# EAGLE design Power Board (EAGLE 6.1)
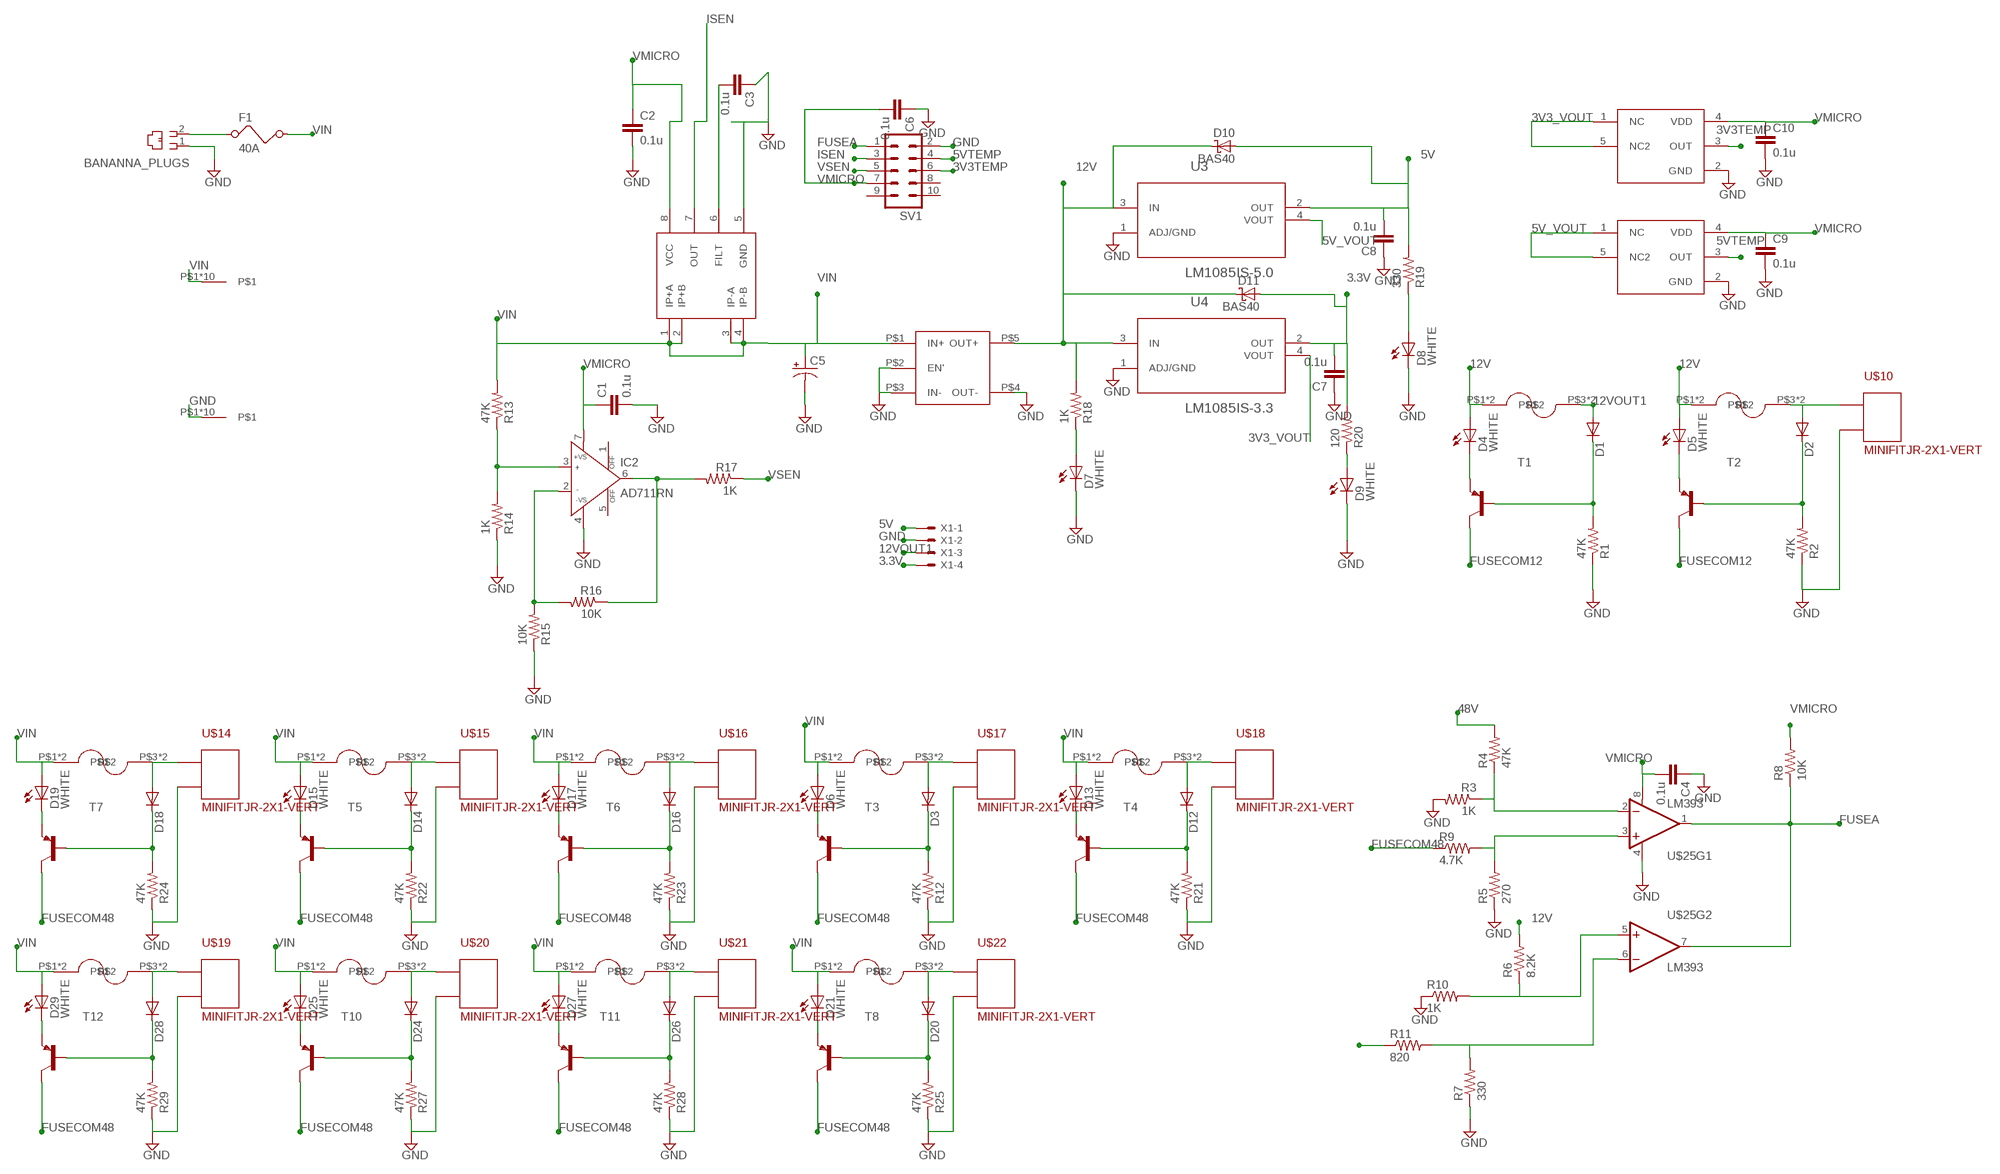
[diagram p0: schematic, sheet 1]

## Parts
BANANNA_PLUGS  520470-4  [520470-4]
C1  0.1u  CAP0805  [0805]
C2  0.1u  CAP0805  [0805]
C3  0.1u  CAP0805  [0805]
C4  0.1u  CAP0805  [0805]
C5  CPOL-USE10-30  [EB30D]
C6  0.1u  CAP0805  [0805]
C7  0.1u  CAP0805  [0805]
C8  0.1u  CAP0805  [0805]
C9  0.1u  CAP0805  [0805]
C10  0.1u  CAP0805  [0805]
D1  DIODEHV  [DIODE-HV]
D2  DIODEHV  [DIODE-HV]
D3  DIODEHV  [DIODE-HV]
D4  WHITE  LED-WHITE  [LED-1206]
D5  WHITE  LED-WHITE  [LED-1206]
D6  WHITE  LED-WHITE  [LED-1206]
D7  WHITE  LED-WHITE  [LED-1206]
D8  WHITE  LED-WHITE  [LED-1206]
D9  WHITE  LED-WHITE  [LED-1206]
D10  BAS40  [SOT23]
D11  BAS40  [SOT23]
D12  DIODEHV  [DIODE-HV]
D13  WHITE  LED-WHITE  [LED-1206]
D14  DIODEHV  [DIODE-HV]
D15  WHITE  LED-WHITE  [LED-1206]
D16  DIODEHV  [DIODE-HV]
D17  WHITE  LED-WHITE  [LED-1206]
D18  DIODEHV  [DIODE-HV]
D19  WHITE  LED-WHITE  [LED-1206]
D20  DIODEHV  [DIODE-HV]
D21  WHITE  LED-WHITE  [LED-1206]
D24  DIODEHV  [DIODE-HV]
D25  WHITE  LED-WHITE  [LED-1206]
D26  DIODEHV  [DIODE-HV]
D27  WHITE  LED-WHITE  [LED-1206]
D28  DIODEHV  [DIODE-HV]
D29  WHITE  LED-WHITE  [LED-1206]
F1  40A  FUSE  [FUSE]
IC2  AD711RN  [SO8]
R1  47K  RESISTOR0805-RES  [0805]
R2  47K  RESISTOR0805-RES  [0805]
R3  1K  RESISTOR0805-RES  [0805]
R4  47K  RESISTOR0805-RES  [0805]
R5  270  RESISTOR0805-RES  [0805]
R6  8.2K  RESISTOR0805-RES  [0805]
R7  330  RESISTOR0805-RES  [0805]
R8  10K  RESISTOR0805-RES  [0805]
R9  4.7K  RESISTOR0805-RES  [0805]
R10  1K  RESISTOR0805-RES  [0805]
R11  820  RESISTOR0805-RES  [0805]
R12  47K  RESISTOR0805-RES  [0805]
R13  47K  RESISTOR0805-RES  [0805]
R14  1K  RESISTOR0805-RES  [0805]
R15  10K  RESISTOR0805-RES  [0805]
R16  10K  RESISTOR0805-RES  [0805]
R17  1K  RESISTOR0805-RES  [0805]
R18  1K  RESISTOR0805-RES  [0805]
R19  330  RESISTOR0805-RES  [0805]
R20  120  RESISTOR0805-RES  [0805]
R21  47K  RESISTOR0805-RES  [0805]
R22  47K  RESISTOR0805-RES  [0805]
R23  47K  RESISTOR0805-RES  [0805]
R24  47K  RESISTOR0805-RES  [0805]
R25  47K  RESISTOR0805-RES  [0805]
R27  47K  RESISTOR0805-RES  [0805]
R28  47K  RESISTOR0805-RES  [0805]
R29  47K  RESISTOR0805-RES  [0805]
SV1  MA05-2  [MA05-2]
T1  BC856BLT1-PNP-SOT23-BEC  [SOT23-BEC]
T2  BC856BLT1-PNP-SOT23-BEC  [SOT23-BEC]
T3  BC856BLT1-PNP-SOT23-BEC  [SOT23-BEC]
T4  BC856BLT1-PNP-SOT23-BEC  [SOT23-BEC]
T5  BC856BLT1-PNP-SOT23-BEC  [SOT23-BEC]
T6  BC856BLT1-PNP-SOT23-BEC  [SOT23-BEC]
T7  BC856BLT1-PNP-SOT23-BEC  [SOT23-BEC]
T8  BC856BLT1-PNP-SOT23-BEC  [SOT23-BEC]
T10  BC856BLT1-PNP-SOT23-BEC  [SOT23-BEC]
T11  BC856BLT1-PNP-SOT23-BEC  [SOT23-BEC]
T12  BC856BLT1-PNP-SOT23-BEC  [SOT23-BEC]
U3  LM1085IS-5.0  [TO254P1435X457-3N]
U4  LM1085IS-3.3  [TO254P1435X457-3N]
U$1  SQE48T20120  [BRICK]
U$2  FUSEHOLDER3557-2  [FUSEHOLDER3557-2]
U$3  FUSEHOLDER3557-2  [FUSEHOLDER3557-2]
U$4  FUSEHOLDER3557-2  [FUSEHOLDER3557-2]
U$5  FUSEHOLDER3557-2  [FUSEHOLDER3557-2]
U$6  FUSEHOLDER3557-2  [FUSEHOLDER3557-2]
U$7  FUSEHOLDER3557-2  [FUSEHOLDER3557-2]
U$8  FUSEHOLDER3557-2  [FUSEHOLDER3557-2]
U$9  FUSEHOLDER3557-2  [FUSEHOLDER3557-2]
U$10  MINIFITJR-2X1-VERT  [5566-02B]
U$11  FUSEHOLDER3557-2  [FUSEHOLDER3557-2]
U$12  FUSEHOLDER3557-2  [FUSEHOLDER3557-2]
U$13  FUSEHOLDER3557-2  [FUSEHOLDER3557-2]
U$14  MINIFITJR-2X1-VERT  [5566-02B]
U$15  MINIFITJR-2X1-VERT  [5566-02B]
U$16  MINIFITJR-2X1-VERT  [5566-02B]
U$17  MINIFITJR-2X1-VERT  [5566-02B]
U$18  MINIFITJR-2X1-VERT  [5566-02B]
U$19  MINIFITJR-2X1-VERT  [5566-02B]
U$20  MINIFITJR-2X1-VERT  [5566-02B]
U$21  MINIFITJR-2X1-VERT  [5566-02B]
U$22  MINIFITJR-2X1-VERT  [5566-02B]
U$25  LM393  [SO08]
U$26  MCP9700T  [SOT353]
U$27  MCP9700T  [SOT353]
U$30  SCREW_TERM  [TERMINAL]
U$31  SCREW_TERM  [TERMINAL]
U$32  ACS713  [SOP08]
X1  KK-156-4  [KK-156-4]

## Nets
3.3V: C7.2 D11.1(A) R20.2 U4.2(OUT) X1.4
3V3_VOUT: U4.4(VOUT) U$27.1(NC) U$27.5(NC2)
3V3TEMP: SV1.6 U$27.3(OUT)
5V: C8.2 D10.1(A) R19.2 U3.2(OUT) X1.1
5V_VOUT: U3.4(VOUT) U$26.1(NC) U$26.5(NC2)
5VTEMP: SV1.4 U$26.3(OUT)
12V: D4.A D5.A D10.3(C) D11.3(C) R6.2 R18.2 U3.3(IN) U4.3(IN) U$1.P$5(OUT+) U$3.P$1 U$3.P$2 U$4.P$1 U$4.P$2
12VOUT1: D1.A U$4.P$3 U$4.P$4 X1.3
48V: R4.2
FUSEA: R8.1 SV1.1 U$25.1(OUT) U$25.7(OUT)
FUSECOM12: R11.1 T1.C T2.C
FUSECOM48: R9.1 T3.C T4.C T5.C T6.C T7.C T8.C T10.C T11.C T12.C
GND: BANANNA_PLUGS.1 C1.2 C2.2 C3.1 C4.1 C5.- C6.1 C7.1 C8.1 C9.2 C10.2 D7.C D8.C D9.C IC2.4(-VS) R1.1 R2.1 R3.2 R5.1 R7.1 R10.1 R12.1 R14.1 R15.1 R21.1 R22.1 R23.1 R24.1 R25.1 R27.1 R28.1 R29.1 SV1.2 U3.1(ADJ/GND) U4.1(ADJ/GND) U$1.P$2(EN') U$1.P$3(IN-) U$1.P$4(OUT-) U$10.P$2 U$14.P$2 U$15.P$2 U$16.P$2 U$17.P$2 U$18.P$2 U$19.P$2 U$20.P$2 U$21.P$2 U$22.P$2 U$25.4(V-) U$26.2(GND) U$27.2(GND) U$31.P$1 U$31.P$2 U$31.P$3 U$31.P$4 U$31.P$5 U$31.P$6 U$31.P$7 U$31.P$8 U$31.P$9 U$31.P$10 U$32.5(GND) X1.2
ISEN: SV1.3 U$32.7(OUT)
N$2: R3.1 R4.1 U$25.2(-IN)
N$3: D2.A U$3.P$3 U$3.P$4 U$10.P$1
N$4: R5.2 R9.2 U$25.3(+IN)
N$5: R6.1 R10.2 U$25.5(+IN)
N$6: R7.2 R11.2 U$25.6(-IN)
N$7: D2.C R2.2 T2.B
N$8: D5.C T2.E
N$9: D3.A U$2.P$3 U$2.P$4 U$17.P$1
N$10: D3.C R12.2 T3.B
N$11: D6.C T3.E
N$12: D1.C R1.2 T1.B
N$13: D4.C T1.E
N$15: C3.2 U$32.6(FILT)
N$16: IC2.3(IN+) R13.1 R14.2
N$17: IC2.2(IN-) R15.2 R16.2
N$18: IC2.6(OUT) R16.1 R17.2
N$21: D7.A R18.1
N$22: D8.A R19.1
N$23: D9.A R20.1
N$25: D12.C R21.2 T4.B
N$26: D13.C T4.E
N$27: BANANNA_PLUGS.2 F1.1
N$28: D12.A U$5.P$3 U$5.P$4 U$18.P$1
N$29: D14.C R22.2 T5.B
N$30: D15.C T5.E
N$32: D14.A U$6.P$3 U$6.P$4 U$15.P$1
N$33: D16.C R23.2 T6.B
N$34: D17.C T6.E
N$36: D16.A U$7.P$3 U$7.P$4 U$16.P$1
N$37: D18.C R24.2 T7.B
N$38: D19.C T7.E
N$40: D18.A U$8.P$3 U$8.P$4 U$14.P$1
N$41: D20.C R25.2 T8.B
N$42: D21.C T8.E
N$44: D20.A U$9.P$3 U$9.P$4 U$22.P$1
N$49: D24.C R27.2 T10.B
N$50: D25.C T10.E
N$52: D24.A U$11.P$3 U$11.P$4 U$20.P$1
N$53: D26.C R28.2 T11.B
N$54: D27.C T11.E
N$56: D26.A U$12.P$3 U$12.P$4 U$21.P$1
N$57: D28.C R29.2 T12.B
N$58: D29.C T12.E
N$60: D28.A U$13.P$3 U$13.P$4 U$19.P$1
VIN: C5.+ D6.A D13.A D15.A D17.A D19.A D21.A D25.A D27.A D29.A F1.2 R13.2 U$1.P$1(IN+) U$2.P$1 U$2.P$2 U$5.P$1 U$5.P$2 U$6.P$1 U$6.P$2 U$7.P$1 U$7.P$2 U$8.P$1 U$8.P$2 U$9.P$1 U$9.P$2 U$11.P$1 U$11.P$2 U$12.P$1 U$12.P$2 U$13.P$1 U$13.P$2 U$30.P$1 U$30.P$2 U$30.P$3 U$30.P$4 U$30.P$5 U$30.P$6 U$30.P$7 U$30.P$8 U$30.P$9 U$30.P$10 U$32.1(IP+A) U$32.2(IP+B) U$32.3(IP-A) U$32.4(IP-B)
VMICRO: C1.1 C2.1 C4.2 C6.2 C9.1 C10.1 IC2.7(+VS) R8.2 SV1.7 U$25.8(V+) U$26.4(VDD) U$27.4(VDD) U$32.8(VCC)
VSEN: R17.1 SV1.5
Unconnected: IC2.1(OFF) IC2.5(OFF) SV1.8 SV1.9 SV1.10

## Library data of the parts
BANANNA_PLUGS = con-amp:520470-4: AMP connector
C1-C4 C6-C10 = SparkFun-Capacitors:CAP: Capacitor Standard 0603 ceramic capacitor, and 0.1" leaded capacitor.
C5 = rcl:CPOL-US: POLARIZED CAPACITOR, American symbol
D1-D3 D12 D14 D16 D18 D20 D24 D26 D28 = SparkFun-DiscreteSemi:DIODE: Diode These are standard reverse protection diodes and small signal diodes. SMA package can handle up to about 1A. SOD-323 can handle about 200mA. What the SOD-323 package when ordering, there are some mfgs out there that are 5-pin packages.
D4-D9 D13 D15 D17 D19 D21 D25 D27 D29 = SparkFun-LED:LED-WHITE: White SMD LEDs LilyPad 1206- DIO-09955; PROD_ID: DIO-09955
D10 D11 = diode:BAS40: Silicon Schottky Diodes General-purpose diode for high-speed switching
F1 = special:FUSE: FUSE 5 x 20 mm
IC2 = analog-devices:AD711: Precision, Low Cost, High Speed, BiFET Op Amp Source: http://www.analog.com/static/imported-files/data_sheets/AD711.pdf; MF: ALTERA CORPORATION; MPN: AD711KRZ; OC_FARNELL: 9426396; OC_NEWARK: 59K4541
R1-R25 R27-R29 = SparkFun-Resistors:RESISTOR: Resistor Basic schematic elements and footprints for 0603, 1206, and PTH resistors.
SV1 = con-lstb:MA05-2: PIN HEADER; OC_FARNELL: unknown; OC_NEWARK: unknown
T1-T8 T10-T12 = transistor:*-PNP-: PNP Transistror
U3 = NSC_By_element14_Batch_1:LM1085IS-5.0: Low Dropout Positive Regulators; MPN: LM1085IS-5.0; OC_FARNELL: 1469040; OC_NEWARK: 41K3374; PACKAGE: TO-263-3; SUPPLIER: National Semiconductor
U4 = NSC_By_element14_Batch_1:LM1085IS-3.3: Low Dropout Positive Regulators; MPN: LM1085IS-3.3; OC_FARNELL: 1469039; OC_NEWARK: 41K3373; PACKAGE: TO-263-3; SUPPLIER: National Semiconductor
U$1 = Power Board Library:SQE48T20120
U$2-U$9 U$11-U$13 = Power Board Library:FUSEHOLDER3557-2
U$10 U$14-U$22 = Personal:MINIFITJR-2X1-VERT
U$25 = SparkFun:LM393
U$26 U$27 = Power Board Library:MCP9700T
U$30 U$31 = Power Board Library:SCREW_TERM
U$32 = main:ACS713
X1 = con-molex:KK-156-4: KK 156 HEADER Source: http://www.molex.com/pdm_docs/sd/026604100_sd.pdf; OC_FARNELL: unknown; OC_NEWARK: unknown

## Board
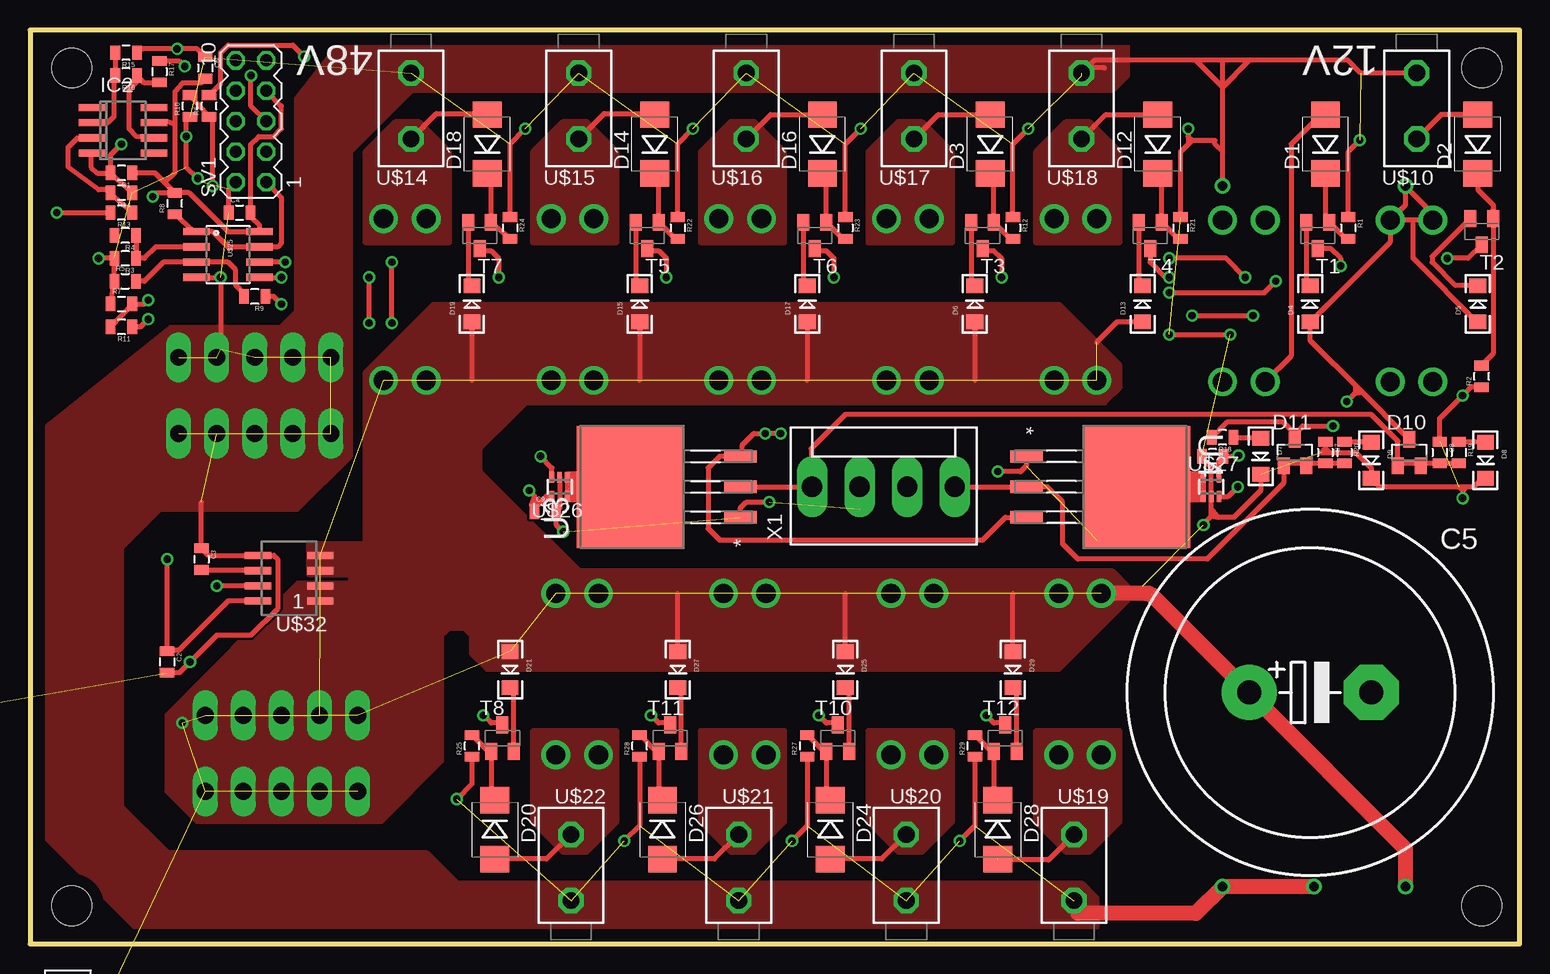
[diagram p1: board, top side]
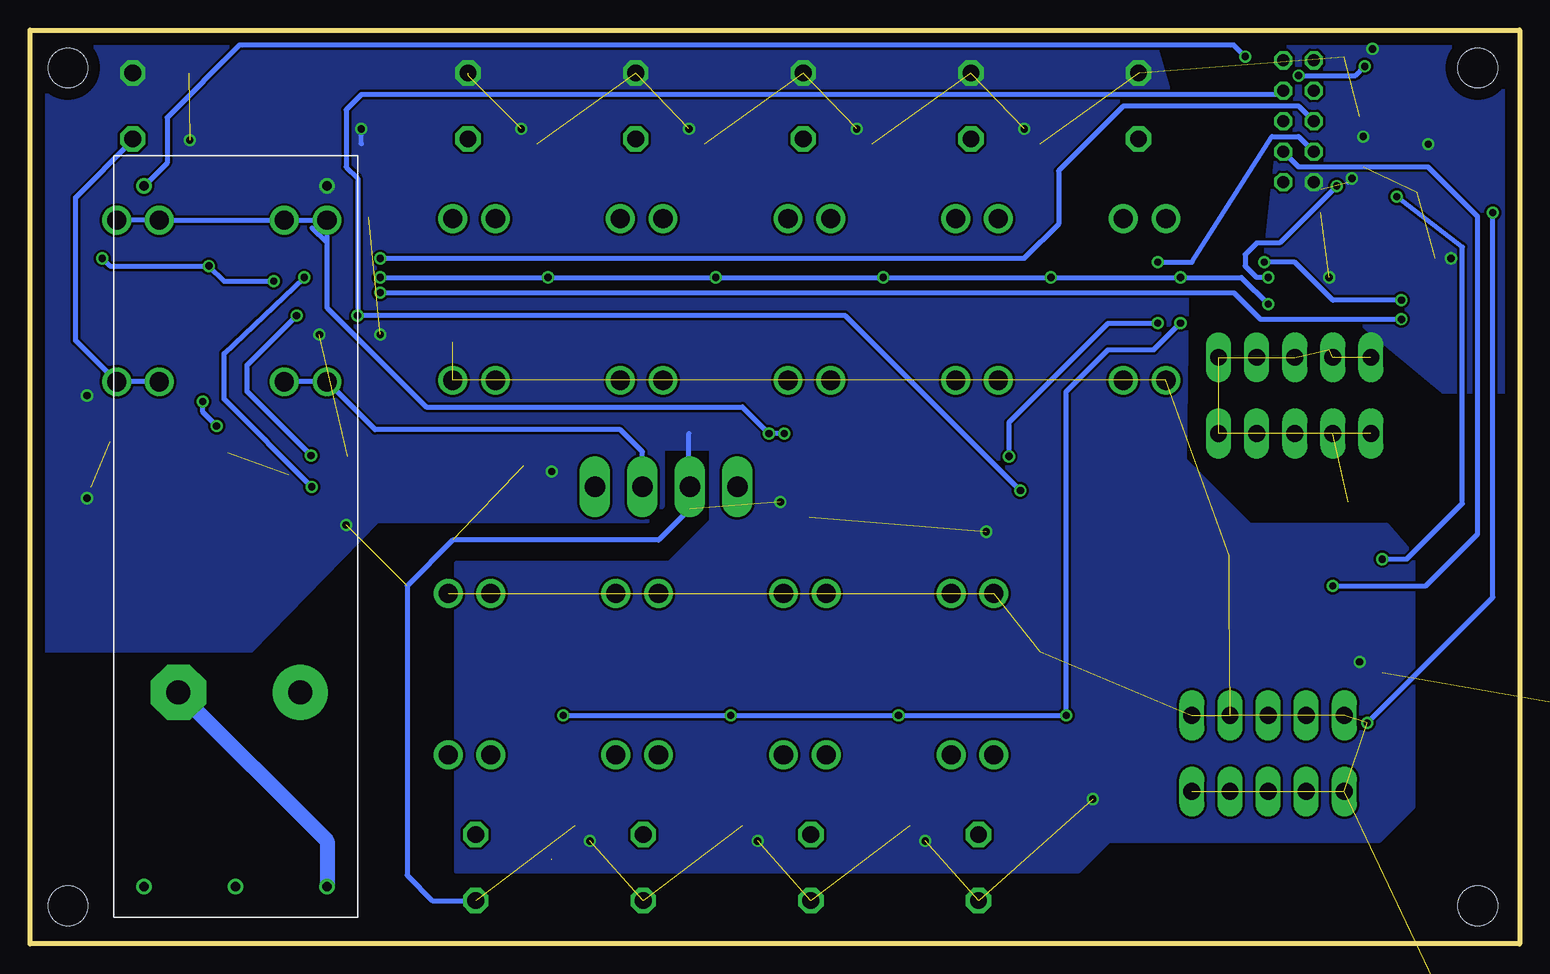
[diagram p2: board, bottom side, seen from below]

Size 124.13 x 76.19 mm. Coordinates in mm from the lower left corner, seen from the top.
Outline: 0,0 124.13,0 124.13,76.19 0,76.19 0,0
Copper layers (1*16): Top 0.035mm / dielectric 1.5mm / Bottom 0.035mm
Design rules: minimum track width 10mil, minimum drill 15mil, track to track 8mil, track to pad 8mil, pad to pad 8mil, via to via 8mil, smd to smd 8mil, copper to edge 40mil, drill to drill 8mil, minimum pad ring 10mil, minimum via ring 8mil, stop-mask expansion 4mil, vias tented up to drill 0mil, thermal gap 10mil

### Footprints (pad centres in the part's own frame; a part is rotated, then mirrored left to right if it is on the bottom)
520470-4 = drill 0.889: 1 -0.635,8.89; 2 0.635,6.35 | hole 3.251: -5.08,0; 5.08,0
0805 = smd 0.8 x 1.2: 1 -0.9,0; 2 0.9,0
EB30D = drill 2.007 pad 4.597: + -5.08,0 | drill 2.007 pad 4.597 octagon: - 5.08,0
DIODE-HV = smd 2.2 x 2.4: A 2.454,0; C -2.454,0
LED-1206 = smd 1.2 x 1.4: A -1.5,0; C 1.5,0
SOT23 = smd 1 x 1.4: 1 -0.95,-1.1; 2 0.95,-1.1; 3 0,1.1
FUSE = drill 1.321 long: 1 -11.43,0; 2 11.43,0
SO8 = smd 0.6 x 2.2: 1 -1.905,-2.6; 2 -0.635,-2.6; 3 0.635,-2.6; 4 1.905,-2.6; 5 1.905,2.6; 6 0.635,2.6; 7 -0.635,2.6; 8 -1.905,2.6
MA05-2 = drill 1.016 octagon: 1 -5.08,-1.27; 2 -5.08,1.27; 3 -2.54,-1.27; 4 -2.54,1.27; 5 0,-1.27; 6 0,1.27; 7 2.54,-1.27; 8 2.54,1.27; 9 5.08,-1.27; 10 5.08,1.27
SOT23-BEC = smd 1 x 1.4: B -0.95,-1.1; C 0,1.1; E 0.95,-1.1
TO254P1435X457-3N = smd 1.016 x 2.692: 1 -2.54,-9.042; 2 0,-9.042; 3 2.54,-9.042 | smd 10.16 x 8.941: 4 0,0.152
BRICK = drill 0.8: P$1 0,7.62; P$2 0,0; P$3 0,-7.62; P$4 58.42,-7.62; P$5 58.42,7.62
FUSEHOLDER3557-2 = drill 1.6: P$1 0,0; P$2 0,3.556; P$3 13.462,0; P$4 13.462,3.556
5566-02B = drill 1.4 octagon: P$1 0,-2.75; P$2 0,2.75
STAND-OFF = hole 3.302: 0,0
SO08 = smd 0.61 x 2.21: 1 -1.905,-2.616; 2 -0.635,-2.616; 3 0.635,-2.616; 4 1.905,-2.616; 5 1.905,2.616; 6 0.635,2.616; 7 -0.635,2.616; 8 -1.905,2.616
SOT353 = smd 0.4 x 0.9: 1 -0.65,-0.8; 2 0,-0.8; 3 0.65,-0.8; 4 0.65,0.8; 5 -0.65,0.8
TERMINAL = drill 1.4 long: P$1 -3.175,0; P$2 3.175,0; P$3 3.175,3.175; P$4 -3.175,3.175; P$5 -3.175,6.35; P$6 3.175,6.35; P$7 3.175,-3.175; P$8 3.175,-6.35; P$9 -3.175,-6.35; P$10 -3.175,-3.175
SOP08 = smd 0.6 x 2.2: 1 -1.905,-2.6; 2 -0.635,-2.6; 3 0.635,-2.6; 4 1.905,-2.6; 5 1.905,2.6; 6 0.635,2.6; 7 -0.635,2.6; 8 -1.905,2.6
KK-156-4 = drill 1.7 pad 2.184 long: 1 -5.94,0; 2 -1.98,0; 3 1.98,0; 4 5.94,0

### Placement (x,y rotation side)
BANANNA_PLUGS  -9.84,9.84 0 top  (outside the outline)
C1  7.62,64.26 180 top
C2  11.43,23.5 270 top
C3  14.29,32.07 270 top
C4  17.46,60.96 0 top
C5  106.68,20.95 0 top
C6  14.61,73.03 270 top
C7  107.95,40.96 270 top
C8  117.47,40.96 270 top
C9  42.93,36 0 top
C10  98.55,40.64 180 top
D1  107.95,66.67 90 top
D2  120.65,66.67 90 top
D3  80.01,66.67 90 top
D4  106.68,53.34 90 top
D5  120.65,53.34 90 top
D6  78.74,53.34 90 top
D7  102.55,40.64 270 top
D8  121.28,40.32 270 top
D9  111.76,40.32 270 top
D10  114.94,40.96 0 top
D11  105.41,40.96 0 top
D12  93.98,66.67 90 top
D13  92.71,53.34 90 top
D14  52.07,66.67 90 top
D15  50.8,53.34 90 top
D16  66.04,66.67 90 top
D17  64.77,53.34 90 top
D18  38.1,66.67 90 top
D19  36.83,53.34 90 top
D20  38.73,9.53 270 top
D21  40.01,22.86 270 top
D24  66.67,9.53 270 top
D25  67.94,22.86 270 top
D26  52.7,9.53 270 top
D27  53.98,22.86 270 top
D28  80.64,9.53 270 top
D29  81.92,22.86 270 top
F1  -5.71,-6.03 0 top  (outside the outline)
IC2  7.75,67.82 270 top
R1  109.86,59.69 270 top
R2  120.97,47.31 90 top
R3  7.94,57.15 180 top
R4  7.94,59.05 180 top
R5  7.94,55.24 0 top
R6  14.92,69.85 90 top
R7  7.62,53.34 0 top
R8  12.06,61.72 90 top
R9  18.73,53.98 180 top
R10  13.34,69.85 90 top
R11  7.62,51.44 180 top
R12  81.92,59.69 270 top
R13  7.62,60.96 180 top
R14  7.62,62.61 180 top
R15  8,74.3 180 top
R16  8,72.39 180 top
R17  10.79,72.71 270 top
R18  99.38,42.23 180 top
R19  119.06,40.96 270 top
R20  109.54,40.96 270 top
R21  95.89,59.69 270 top
R22  53.98,59.69 270 top
R23  67.94,59.69 270 top
R24  40.01,59.69 270 top
R25  36.83,16.51 90 top
R27  64.77,16.51 90 top
R28  50.8,16.51 90 top
R29  78.74,16.51 90 top
SV1  18.41,68.58 90 top
T1  107.31,59.05 180 top
T2  120.97,59.37 180 top
T3  79.38,59.05 180 top
T4  93.34,59.05 180 top
T5  51.44,59.05 180 top
T6  65.41,59.05 180 top
T7  37.47,59.05 180 top
T8  39.37,17.14 0 top
T10  67.31,17.14 0 top
T11  53.34,17.14 0 top
T12  81.28,17.14 0 top
U3  50.16,38.1 90 top
U4  92.08,38.1 270 top
U$1  107,4.76 90 bottom
U$2  74.93,46.99 90 top
U$3  113.35,60.33 270 top
U$4  99.38,60.33 270 top
U$5  88.9,46.99 90 top
U$6  46.99,46.99 90 top
U$7  60.96,46.99 90 top
U$8  33.02,46.99 90 top
U$9  43.81,29.21 270 top
U$10  115.57,69.85 0 top
U$11  71.75,29.21 270 top
U$12  57.78,29.21 270 top
U$13  85.72,29.21 270 top
U$14  31.75,69.85 0 top
U$15  45.72,69.85 0 top
U$16  59.69,69.85 0 top
U$17  73.66,69.85 0 top
U$18  87.63,69.85 0 top
U$19  87,6.35 180 top
U$20  73.03,6.35 180 top
U$21  59.05,6.35 180 top
U$22  45.09,6.35 180 top
U$23  [STAND-OFF]  3.49,3.17 0 top
U$24  [STAND-OFF]  120.97,3.17 0 top
U$25  16.51,57.47 270 top
U$26  44.13,38.1 180 top
U$27  98.42,38.1 0 top
U$28  [STAND-OFF]  120.97,73.03 0 top
U$29  [STAND-OFF]  3.49,73.03 0 top
U$30  20.95,15.88 90 top
U$31  18.73,45.72 90 top
U$32  21.59,30.48 90 top
X1  71.12,38.1 0 top

### Tracks (layer width: path | path; a pad name or v marks a point on that pad's centre or on a via)
3.3V
  Top 0.406: X1.4 U4.2 84.77,38.1 86.04,36.83 86.04,33.34 87.31,32.07 98.11,32.07 104.46,38.42 D11.1 104.66,40.06 C7.2 R20.2
3V3_VOUT
  Top 0.406: U4.4 92.23,38.9 U$27.5 U$27.1
3V3TEMP  (via drill 0.6)
  Top 0.406: v101.28,55.56 99.69,57.15 v94.93,57.15 | U$27.3 99.85,37.3 v100.65,38.1
  Bottom 0.406: v101.28,55.56 107.95,49.21 107.95,45.4 v100.65,38.1 | v94.93,57.15 41.27,57.15 38.42,60.01 38.42,64.45 33.02,69.85 18.41,69.85 SV1.6
5V
  Top 0.406: U3.2 X1.1 65.09,38.19 65.09,41.27 67.94,44.13 111.76,44.13 113.98,41.91 D10.1 114.19,40.06 C8.2 R19.2
5V_VOUT
  Top 0.406: U3.4 50.01,38.9 U$26.1 U$26.5
5VTEMP  (via drill 0.6)
  Top 0.406: v42.55,40.64 43.5,39.69 43.5,38.91 U$26.3 | v30.16,51.75 v30.16,56.83
  Bottom 0.406: v42.55,40.64 42.55,43.5 34.29,51.75 v30.16,51.75 | v30.16,56.83 27.3,56.83 20.64,67.31 18.41,67.31 SV1.4
12V  (via drill 0.6)
  Top 0.406: U3.3 59.37,40.8 | 59.37,40.8 59.37,41.59 60.33,42.55 v61.28,42.55 v62.55,42.55 | D4.A 106.45,51.84 | U$3.P$1 114.62,61.59 U$1.P$5 116.9,60.9 U$3.P$2 115.25,60.33 | 115.25,60.33 U$3.P$1 | U$3.P$1 113.35,58.51 D4.A | D5.A 120.65,51.75 115.25,57.15 115.25,60.33 | 59.37,40.8 59.37,40.64 57.47,40.64 56.52,39.69 56.52,34.61 57.47,33.66 79.38,33.66 81.28,35.56 U4.3 | R6.2 15.88,71.7 15.88,74.3 16.51,74.93 21.91,74.93 v22.86,73.98 | D11.3 105.41,42.55 | 98.42,42.23 R18.2 99.75,43.5 104.46,43.5 105.41,42.55 | 105.41,42.55 106.05,43.18 v108.58,43.18 | D10.3 110.75,46.24 | 110.75,46.24 106.68,50.31 D4.A | v109.73,45.21 110.75,46.24
  Bottom 0.406: v61.28,42.55 v62.55,42.55 64.77,44.77 91.12,44.77 99.38,53.02 99.38,58.42 | 116.84,60.33 U$3.P$1 U$4.P$2 U$4.P$1 99.38,58.42 | 99.38,58.42 100.65,59.69 | U$1.P$5 112.71,65.09 112.71,68.9 106.68,74.93 23.81,74.93 v22.86,73.98 | v108.58,43.18 109.73,44.32 v109.73,45.21
12VOUT1
  Top 0.406: D1.A 107.55,69.13 105.09,66.67 105.09,49.02 U$4.P$4
  Bottom 0.406: X1.3 73.1,41.03 74.93,42.86 95.38,42.86 U$4.P$3 U$4.P$4
FUSEA
  Top 0.406: SV1.1 20.95,62.23 20.95,58.42 20.64,58.1 U$25.7 16.51,58.1 15.24,59.37 U$25.1 13.65,59.37 R8.1
FUSECOM12  (via drill 0.6)
  Top 0.406: T2.C 119.84,57.15 v118.11,57.15 | v109.22,56.52 109.22,57.15 108.42,57.95 T1.C | v94.93,54.29 102.87,54.29 v103.82,55.24 | v9.84,52.07 9.21,51.44 R11.1
  Bottom 0.406: v118.11,57.15 117.47,56.52 v109.22,56.52 107.95,55.24 v103.82,55.24 | v94.93,54.29 23.81,54.29 21.59,52.07 v9.84,52.07
FUSECOM48  (via drill 0.6)
  Top 0.406: T4.C 93.49,57.95 93.34,57.81 93.34,56.83 94.61,55.56 v94.93,55.56 | T3.C 79.2,57.78 80.33,57.78 80.96,57.15 v80.96,55.56 | T6.C 65.58,57.78 66.36,57.78 66.99,57.15 v66.99,55.56 | T5.C 51.6,57.78 52.39,57.78 53.02,57.15 v53.02,55.56 | T7.C 37.63,57.78 38.42,57.78 39.05,57.15 v39.05,55.56 | T12.C 81.11,18.41 80.33,18.41 v79.69,19.05 | T10.C 67.14,18.41 66.36,18.41 v65.72,19.05 | T11.C 53.17,18.41 52.39,18.41 v51.75,19.05 | T8.C 39.2,18.41 38.42,18.41 v37.78,19.05 | v20.95,53.34 20.32,53.98 R9.1 | v28.26,51.75 v28.26,55.56
  Bottom 0.406: v94.93,55.56 v80.96,55.56 v66.99,55.56 v53.02,55.56 v39.05,55.56 v28.26,55.56 23.18,55.56 v20.95,53.34 | v79.69,19.05 v65.72,19.05 v51.75,19.05 v37.78,19.05 37.78,46.04 34.29,49.53 30.48,49.53 v28.26,51.75
GND  (via drill 0.6)  (43 unrouted)
  Top 0.406: 89.53,73.03 88.27,73.03 87.63,72.39 | U3.1 59.21,36.35 59.69,36.83 v61.59,36.83 | C2.2 12.44,22.59 v13.34,23.5 15.56,25.72 18.41,25.72 20.64,27.94 20.64,32.07 20.32,32.38 U$32.5 14.87,32.38 C3.1 14.29,36.83 | 101.6,73.66 109.86,73.66 110.92,72.6 U$10.P$2 | 101.6,73.66 99.38,73.66 | 99.38,73.66 97.16,73.66 | 97.16,73.66 88.69,73.66 U$18.P$2 | U$1.P$4 99.38,66.04 | 99.38,66.04 99.38,71.44 | 99.38,71.44 99.38,73.66 | 97.16,73.66 99.38,71.44 | 99.38,71.44 101.6,73.66 | 87.31,2.54 87,2.86 U$19.P$2 | U4.1 83.03,39.85 82.55,39.37 v80.64,39.37 | R2.1 120.07,46.41 v119.38,45.72 117.47,43.81 C8.1 | R21.1 95.89,66.04 96.52,66.67 | 96.52,66.67 96.84,66.99 | R1.1 109.86,66.04 v110.81,66.99 | R12.1 81.92,66.67 v83.19,67.94 | R23.1 67.94,66.67 v69.22,67.94 | R22.1 53.98,66.67 v55.24,67.94 | R24.1 40.01,66.67 v41.27,67.94 | R25.1 36.83,13.34 v35.56,12.06 | R28.1 50.8,9.84 v49.53,8.57 | R27.1 64.77,9.84 v63.5,8.57 | R29.1 78.74,9.84 v77.47,8.57 | D8.C 121.06,38.82 120.33,38.1 119.7,38.1 | 119.38,38.1 119.06,38.1 | 119.06,38.1 112.48,38.1 D9.C 111.76,39.69 110.49,40.96 108.27,40.96 | C7.1 107.95,41.27 | 107.95,41.27 108.27,40.96 | 107.95,41.27 107.63,40.96 108.27,40.96 | 119.7,38.1 119.38,38.1 | 119.38,38.1 119.38,37.78 | 119.38,37.78 v119.38,37.15 | 119.7,38.1 119.38,37.78 | 119.38,37.78 119.06,38.1 | C4.1 16.56,62.92 SV1.2 | R10.1 13.02,68.95 v13.02,67.31 13.02,64.77 v13.97,63.82 | U$25.4 v15.88,55.56 15.88,49.53 | R7.1 R5.1 R3.2 v5.71,57.15 | C1.2 R14.1 | v7.62,66.67 6.72,65.78 C1.2 | C6.1 13.92,74.61 v12.26,74.61 9.4,74.61 8.9,74.62 R15.1 | v94.93,50.8 v100.01,50.8 | U$26.2 44.13,36.31 C9.2 43.83,34.98 v44.45,34.35 | C10.2 98.42,39.74 U$27.2 98.42,36.2
  Top 0.406: D7.C 102.55,37.78 100.33,35.56 99.06,35.56 | 99.06,35.56 98.68,35.94 | 98.68,35.94 98.42,36.2 | v97.79,34.92 97.79,35.05 98.42,35.69 | 98.42,35.69 98.68,35.94 | 98.42,35.69 98.42,36.2 | 98.42,35.69 99.06,35.56 | IC2.4 5.08,65.85 5.08,64.77 5.59,64.26 C1.2 | 99.38,66.04 98.74,66.67 98.74,66.99 96.84,66.99 | v96.52,67.94 96.52,67.31 | 96.52,67.31 96.52,66.67 | 96.52,67.31 96.84,66.99
  Top 1.27: 87.31,2.54 97.16,2.54 U$1.P$3 U$1.P$2
  Bottom 0.406: U$19.P$2 90.59,3.6 92.71,5.71 92.71,29.84 88.9,33.66 71.75,33.66 69.14,36.27 X1.2 69.22,38.1 69.22,42.55 | v13.97,63.82 14.29,63.5 | 96.52,66.67 v96.52,67.94
  Bottom 1.27: C5.- 99.38,8.57 U$1.P$3
  pour Top (no thermals): 35.56,5.08 87.63,5.08 88.9,3.81 88.9,1.27 87.63,0 10.16,0 0.64,9.53 0.64,42.55 11.75,51.44 20.95,51.44 22.23,52.7 22.23,70.48 26.67,76.2 90.17,76.2 91.44,74.93 91.44,72.39 90.17,71.12 31.75,71.12 26.67,66.04 26.67,40.64 22.23,36.2 10.79,36.2 7.62,33.02 7.62,11.43 11.43,7.62 33.02,7.62
  pour Bottom (no thermals): 0,76.2 0,46.04 6.35,46.04 13.65,52.07 20.64,52.07 21.59,53.02 19.05,76.2
  pour Bottom (no thermals): 11.11,34.92 8.89,32.38 8.89,11.43 11.75,8.57 34.29,8.57 36.83,6.03 88.58,6.03 88.58,31.75 70.8,31.75 67.31,35.24 67.31,41.27 71.44,41.27 71.44,36.51 72.71,35.24 95.25,35.24 105.73,24.45 122.87,24.45 123.19,75.56 30.48,75.25 27.62,65.41 27.94,40.32 22.54,34.92
ISEN  (via drill 0.6)
  Top 0.406: U$32.7 v15.56,29.84
  Bottom 0.406: SV1.3 18.41,64.77 7.62,64.77 3.49,60.64 3.49,34.16 7.8,29.84 v15.56,29.84
N$1
  Top 0.406: 110.49,46.1 110.49,46.48
N$2
  Top 0.406: R4.1 R3.1 9.53,57.15 10.48,58.1 U$25.2
N$3
  Top 0.406: D2.A 117.6,69.13 U$10.P$1
  Bottom 0.406: U$3.P$3 U$3.P$4 120.33,50.29 120.33,62.23 115.57,66.99 U$10.P$1
N$4
  Top 0.406: R9.2 17.78,54.29 17.14,54.93 17.14,56.2 16.51,56.83 U$25.3 11.11,56.83 9.53,55.24 R5.2
N$5  (via drill 0.6)
  Top 0.406: R10.2 R6.1 15.24,68.63 v15.24,63.18 | U$25.5 v20.95,55.56
  Bottom 0.406: v20.95,55.56 21.91,55.56 22.86,56.52 22.86,57.47 21.91,58.42 20,58.42 v15.24,63.18
N$6  (via drill 0.6)
  Top 0.406: R11.2 8.57,53.34 | 8.57,53.34 9.53,53.34 v9.84,53.66 | v21.27,56.83 U$25.6 | R7.2 8.57,53.34
  Bottom 0.406: v9.84,53.66 15.56,53.66 18.73,56.83 v21.27,56.83
N$7
  Top 0.406: D2.C 120.65,62.87 121.92,61.59 121.92,61.28 | 121.92,61.28 121.92,49.21 120.97,48.26 R2.2 | T2.B 121.92,61.27 121.92,61.28
N$8
  Top 0.406: D5.C 120.65,54.93 118.75,54.93 116.84,56.83 116.84,57.3 T2.E
N$9
  Top 0.406: U$17.P$1 75.69,69.13 D3.A
  pour Top (no thermals): 76.83,58.42 69.85,58.42 69.85,66.04 72.39,68.58 74.3,68.58 76.83,66.04
N$10
  Top 0.406: R12.2 81.69,58.79 T3.B 80.33,63.91 D3.C
N$11
  Top 0.406: T3.E 78.42,54.52 D6.C
N$12
  Top 0.406: R1.2 109.63,58.79 T1.B 107.95,60.47 D1.C
N$13
  Top 0.406: T1.E 106.36,55.16 D4.C
N$14
  Top 0.406: 110.62,45.97 110.87,45.97
N$15
  Top 0.406: C3.2 19,31.17 19.05,31.11 U$32.6
N$16
  Top 0.406: R13.1 6.72,62.49 6.67,62.55 | 6.67,62.55 6.35,62.87 5.71,62.87 3.17,64.77 3.17,66.42 3.94,67.18 IC2.3 | R14.2 6.67,62.87 6.67,62.55
N$17
  Top 0.406: R15.2 R16.2 6.99,72.12 6.99,68.96 6.48,68.45 IC2.2
N$18
  Top 0.406: IC2.6 8.89,67.31 8.26,67.94 8.26,71.25 8.9,71.89 R16.1 9.48,71.81 R17.2
N$21
  Top 0.406: R18.1 102.55,42.23 D7.A
N$22
  Top 0.406: R19.1 121.25,41.86 D8.A
N$23
  Top 0.406: R20.1 111.72,41.86 D9.A
N$24
  Top 0.406: 96.2,37.47 96.2,37.15
N$25
  Top 0.406: R21.2 95.66,58.79 T4.B 94.3,63.91 D12.C
N$26
  Top 0.406: T4.E 92.39,54.52 D13.C
N$27  (1 unrouted)
N$28
  Top 0.406: U$18.P$1 89.66,69.13 D12.A
  pour Top (no thermals): 90.81,58.42 83.82,58.42 83.82,66.04 86.36,68.58 88.27,68.58 90.81,66.04
N$29
  Top 0.406: R22.2 53.75,58.79 T5.B 52.38,63.91 D14.C
N$30
  Top 0.406: T5.E 50.48,54.52 D15.C
N$32
  Top 0.406: U$15.P$1 47.84,69.22 52.07,69.22 D14.A
  pour Top (no thermals): 48.9,58.42 41.91,58.42 41.91,66.04 44.45,68.58 46.35,68.58 48.9,66.04
N$33
  Top 0.406: R23.2 67.72,58.79 T6.B 66.36,63.82 65.41,64.77 65.49,64.77 D16.C
N$34
  Top 0.406: T6.E 64.45,54.52 D17.C
N$36
  Top 0.406: U$16.P$1 61.72,69.13 D16.A
  pour Top (no thermals): 62.87,58.42 55.88,58.42 55.88,66.04 58.42,68.58 60.33,68.58 62.87,66.04
N$37
  Top 0.406: D18.C 38.41,63.91 T7.B 38.62,59.95 R24.2
N$38
  Top 0.406: T7.E 36.52,54.52 D19.C
N$40
  Top 0.406: U$14.P$1 33.87,69.22 38.1,69.22 D18.A
  pour Top (no thermals): 34.92,58.42 27.94,58.42 27.94,66.04 30.48,68.58 32.38,68.58 34.92,66.04
N$41
  Top 0.406: D20.C 38.42,12.29 T8.B 38.2,16.05 R25.2
N$42
  Top 0.406: T8.E 40.32,21.68 D21.C
N$44
  Top 0.406: U$22.P$1 43.06,7.07 D20.A
  pour Top (no thermals): 41.91,17.78 48.9,17.78 48.9,10.16 46.35,7.62 44.45,7.62 41.91,10.16
N$49
  Top 0.406: D24.C 66.36,12.29 T10.B 66.14,16.05 R27.2
N$50
  Top 0.406: T10.E 68.26,20.96 67.94,21.27 D25.C
N$52
  Top 0.406: U$20.P$1 71,7.07 D24.A
  pour Top (no thermals): 69.85,17.78 76.83,17.78 76.83,10.16 74.3,7.62 72.39,7.62 69.85,10.16
N$53
  Top 0.406: D26.C 52.39,12.29 T11.B 52.16,16.05 R28.2
N$54
  Top 0.406: T11.E 54.29,21.68 D27.C
N$56
  Top 0.406: U$21.P$1 57.03,7.07 D26.A
  pour Top (no thermals): 55.88,17.78 62.87,17.78 62.87,10.16 60.33,7.62 58.42,7.62 55.88,10.16
N$57
  Top 0.406: D28.C 80.33,12.29 T12.B 80.11,16.05 R29.2
N$58
  Top 0.406: T12.E 82.23,21.68 D29.C
N$60  (1 unrouted)
  Top 0.406: U$19.P$1 84.88,6.99 80.64,6.99
  pour Top (no thermals): 83.82,17.78 90.81,17.78 90.81,10.16 88.27,7.62 86.36,7.62 83.82,10.16
VIN  (via drill 0.6)  (42 unrouted)
  Top 0.406: D19.A 36.83,46.99 | D15.A 50.8,46.99 | D17.A 64.77,46.99 | D6.A 78.74,46.99 | D29.A 81.92,29.21 | D25.A 67.94,29.21 | D27.A 53.98,29.21 | D13.A 90.58,51.84 88.9,50.16 | v2.22,60.96 R13.2
  Top 1.27: U$13.P$2 93.03,29.21 93.34,29.21 C5.+ 114.62,7.94 U$1.P$1
  Bottom 0.406: v2.22,60.96 2.22,28.89 v12.7,18.41
  pour Top (no thermals): 45.72,31.11 90.17,31.11 91.44,29.84 91.44,28.57 85.72,22.86 38.1,22.86 36.83,24.13 36.83,29.21 35.18,30.86 29.46,30.86 27.94,32.38 27.94,47.62 33.66,53.34 85.72,53.34 90.81,48.26 90.81,46.35 89.53,45.09 41.27,45.09 37.47,41.27 37.47,39.37
  pour Top (no thermals): 11.43,19.05 22.35,30.1 32.77,30.1 34.29,28.57 34.29,15.24 29.21,10.16 13.97,10.16 11.43,12.7
  pour Top (no thermals): 23.18,30.8 26.67,30.8 26.67,25.4 33.97,25.4 34.92,26.35 36.2,26.35 36.83,25.72 36.83,33.34 23.18,33.34
VMICRO  (via drill 0.6)
  Top 0.406: v11.43,32.07 C2.1 11.48,24.45 12.38,24.45 16.51,28.57 U$32.8 | v96.84,52.39 v101.92,52.39 | v100.71,40.7 C10.1 99.08,40.26 U$27.4 | C4.2 18.41,60.96 | 18.41,60.96 18.41,66.67 19.05,67.31 20.32,67.31 20.95,67.94 20.95,69.85 SV1.7 | 18.41,60.96 18.41,60.64 19.13,59.93 U$25.8 16.51,59.37 13.26,62.62 R8.2 | v41.59,37.78 42.03,37.35 42.03,36.83 | 42.03,36.83 C9.1 | 42.42,36.83 42.03,36.83 | 42.16,36.45 42.55,36.83 | 42.55,36.83 42.42,36.83 | 42.42,36.83 42.04,37.21 41.78,36.58 | U$26.4 43.02,37.3 42.55,36.83 | v10.22,62.29 10.55,62.62 R8.2 | R8.2 11.24,63.44 | 11.24,63.44 10.43,64.26 C1.1 | IC2.7 10.47,68.58 11.43,68.58 12.06,68.33 | 12.06,68.33 12.06,64.26 11.24,63.44 | C6.2 14.23,71.75 12.7,71.75 12.06,71.06 12.06,68.33
  Bottom 0.406: SV1.7 20,70.8 96.52,70.8 97.79,69.53 97.79,64.77 96.84,63.82 v96.84,52.39 56.2,52.39 v41.59,37.78 | v100.71,40.7 106.05,46.04 106.05,48.26 v101.92,52.39 | v10.22,62.29 4.76,58.1 4.76,36.71 9.4,32.07 v11.43,32.07
VSEN  (via drill 0.6)
  Top 0.406: SV1.5 18.41,69.85 v18.41,72.39 | R17.1 12.44,73.61 v12.89,73.15
  Bottom 0.406: v18.41,72.39 13.65,72.39 v12.89,73.15
(copper drawn outside any net)
  shapes: Top area x2

### Text on the board
tPlace: 48V | 12V